# EasyEDA schematic simulation_json.json
TITLE: Sheet_1; REV: 1.0; Date: 2020-10-17; Sheet: 1/1; Drawn By: lipuchka123; Company: Your Company
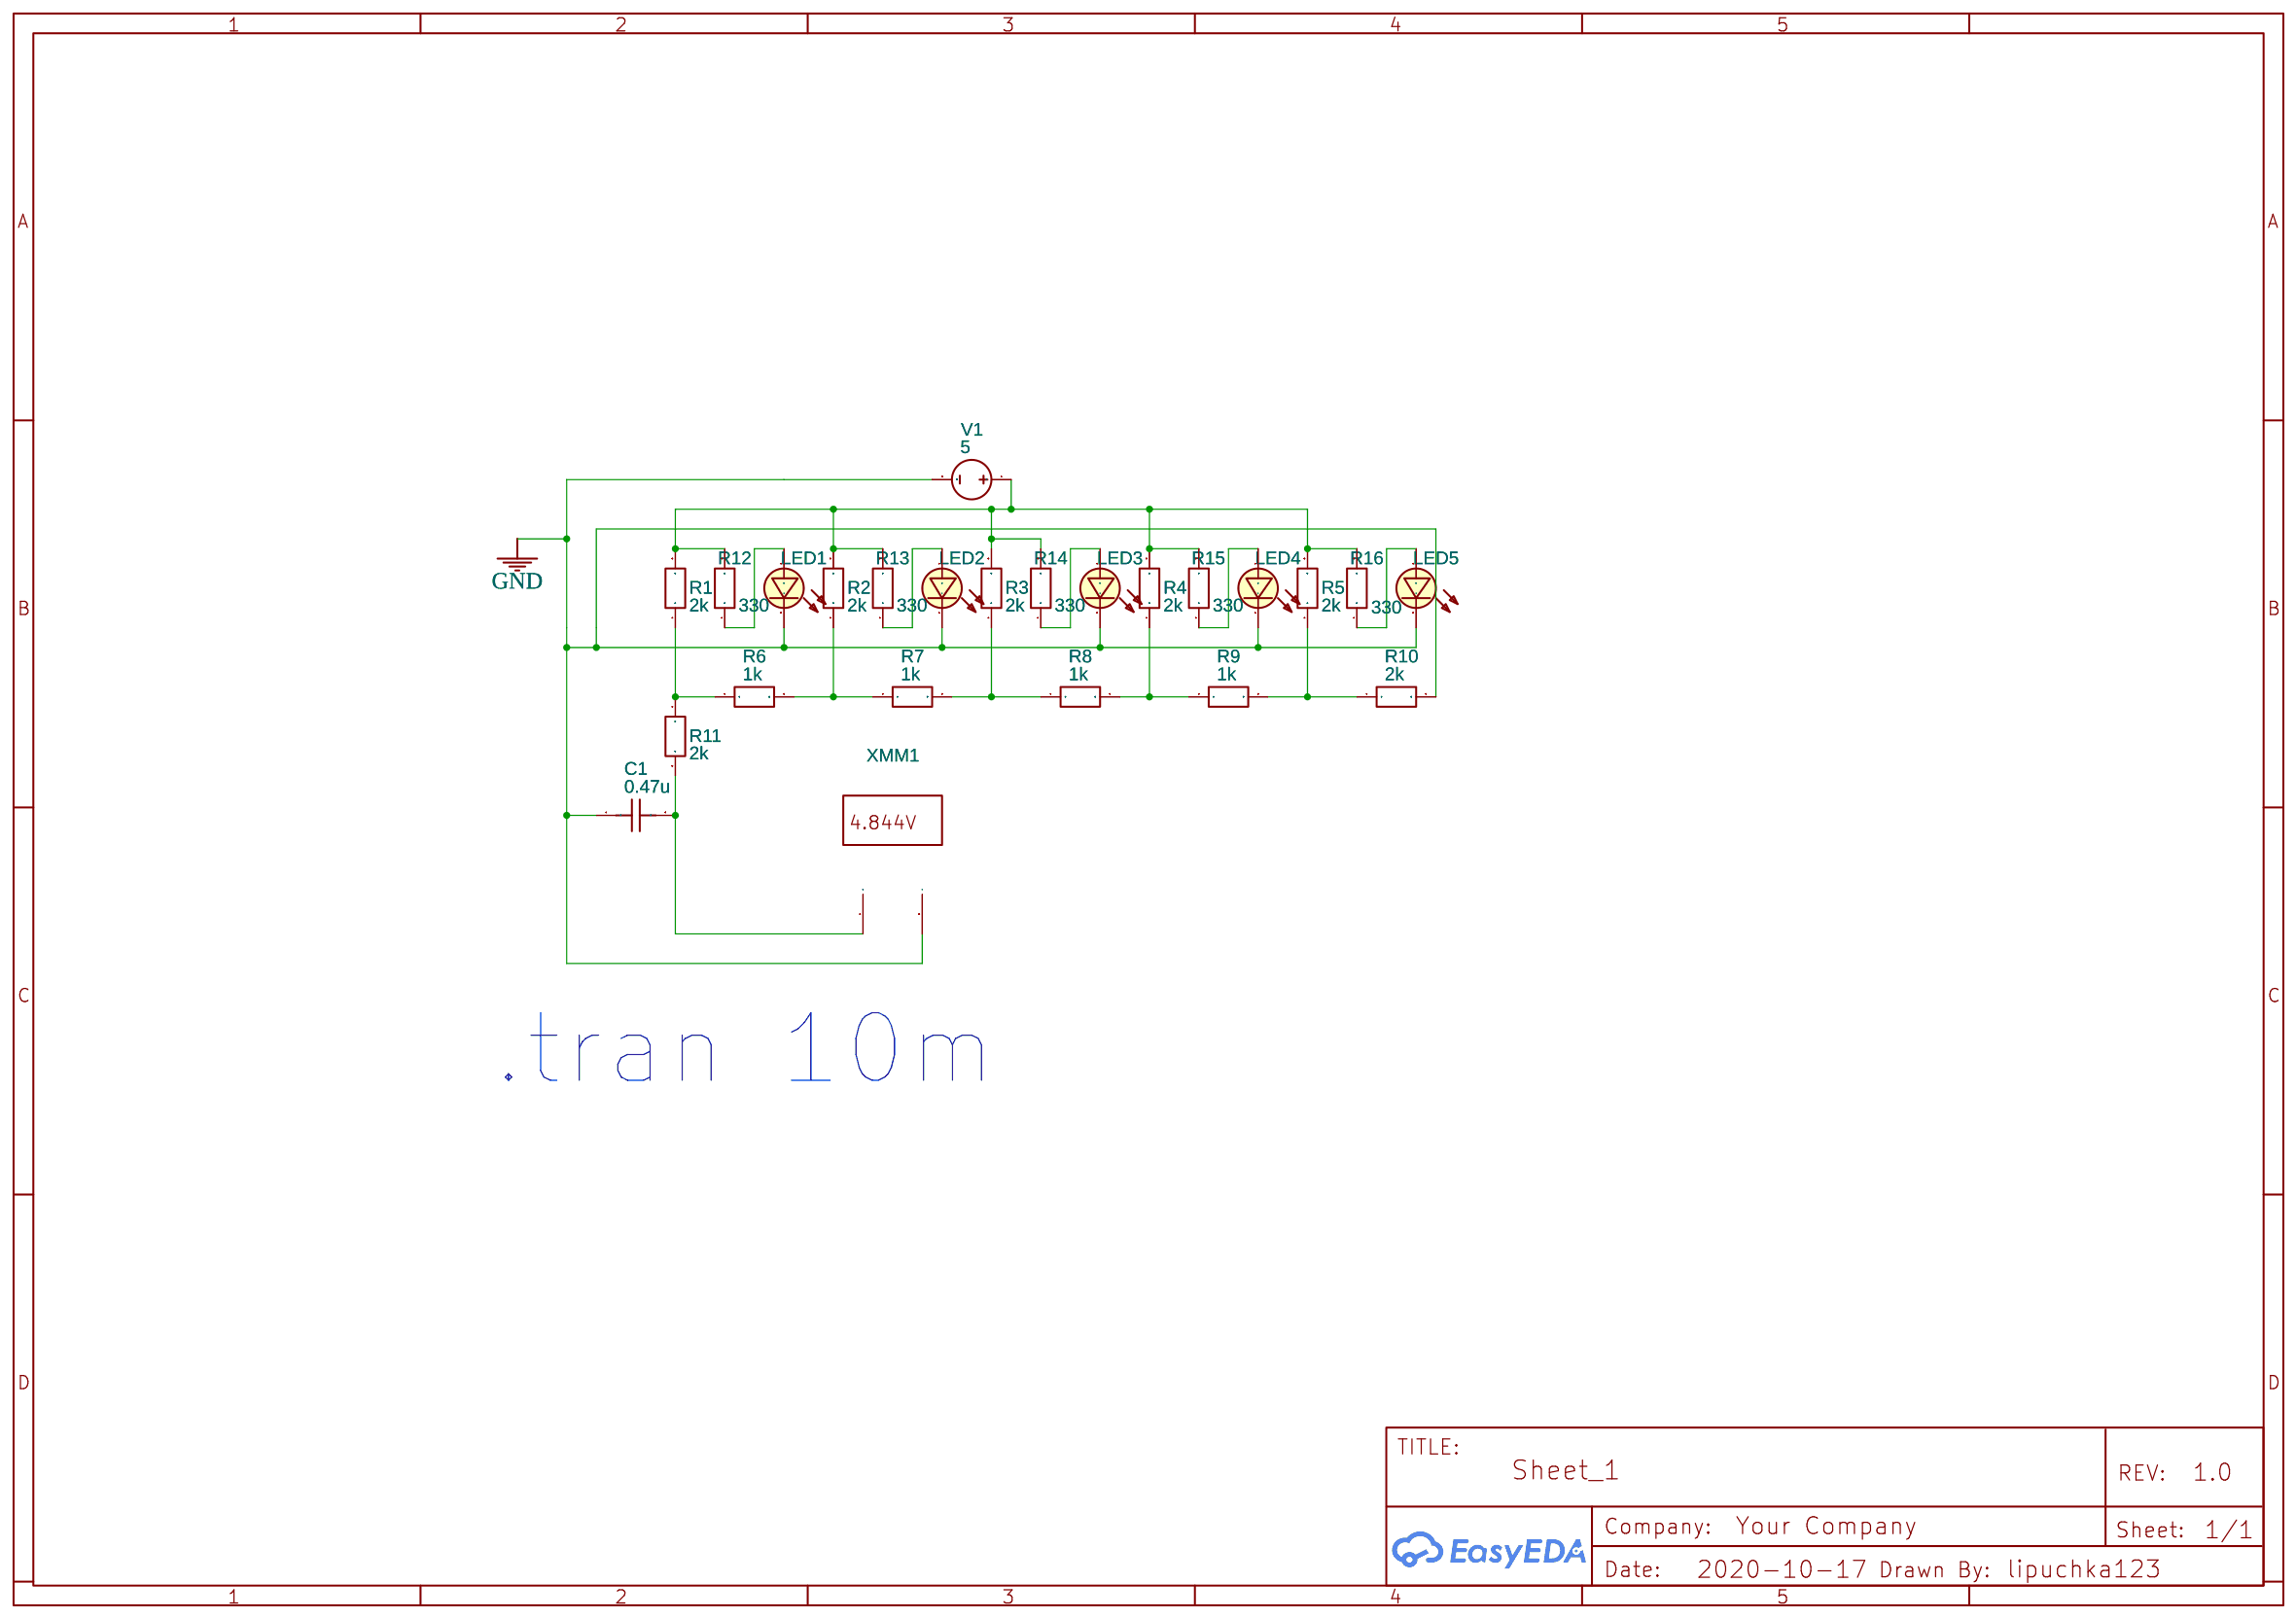
[diagram p0: schematic sheet]

## Parts
C1  0.47u  [C0603]
LED1  LED
LED2  LED
LED3  LED
LED4  LED
LED5  LED
R1  2k  [R0402]
R2  2k  [R0402]
R3  2k  [R0402]
R4  2k  [R0402]
R5  2k  [R0402]
R6  1k  [R0402]
R7  1k  [R0402]
R8  1k  [R0402]
R9  1k  [R0402]
R10  2k  [R0402]
R11  2k  [R0402]
R12  330  [R0402]
R13  330  [R0402]
R14  330  [R0402]
R15  330  [R0402]
R16  330  [R0402]
V1  5  [HDR1X2]
XMM1  Multimeter

## Library data of the parts
C1 = C_0603_US: Contributor: LCEDA_Lib
LED1-LED5 = LED: catid: 20; Contributor: 仿真库绘制; Color: Red; NameDisplay: 0
R1-R16 = R_0402_EU: Contributor: LCEDA_Lib
V1 = VDC: Contributor: EasyEDA; sim: true
XMM1 = MULTIMETER: Supplier: LCSC; Multimeter Type: Voltmeter; Power Type: AC; Voltmeter resistance: 10μ; Ammeter resistance: 1G; NameDisplay: 0; Contributor: EasyEDA; sim: true

## Nets
GND: C1.1 LED1.2(-) LED2.2(-) LED3.2(-) LED4.2(-) LED5.2(-) R10.2 V1.2 XMM1.2(I)
Net-(C1-2): C1.2 R11.2 XMM1.1(+)
Net-(LED1-1): LED1.1(+) R12.1
Net-(LED2-1): LED2.1(+) R13.1
Net-(LED3-1): LED3.1(+) R14.1
Net-(LED4-1): LED4.1(+) R15.1
Net-(LED5-1): LED5.1(+) R16.1
Net-(R1-1): R1.1 R6.1 R11.1
Net-(R1-2): R1.2 R2.2 R3.2 R4.2 R5.2 R12.2 R13.2 R14.2 R15.2 R16.2 V1.1
Net-(R2-1): R2.1 R6.2 R7.1
Net-(R3-1): R3.1 R7.2 R8.1
Net-(R4-1): R4.1 R8.2 R9.1
Net-(R5-1): R5.1 R9.2 R10.1

## Notes on the sheet
- .tran 10m
